# EAGLE design adapter_nucleo_f446re (EAGLE 9.5.0)
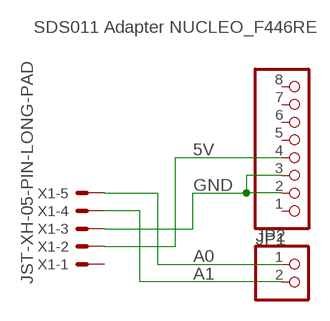
[diagram p0: schematic, sheet 1]

## Parts
JP1  PINHD-1X8  [1X08]
JP2  PINHD-1X2  [1X02]
X1  JST-XH-05-PIN-LONG-PAD  [JST-XH-05-PACKAGE-LONG-PAD]

## Nets
5V: JP1.4 X1.2
A0: JP2.1 X1.5
A1: JP2.2 X1.4
GND: JP1.2 JP1.3 X1.3
Unconnected: JP1.1 JP1.5 JP1.6 JP1.7 JP1.8 X1.1

## Notes on the sheet
- SDS011 Adapter NUCLEO_F446RE

## Library data of the parts
JP1 = pinhead:PINHD-1X8: PIN HEADER
JP2 = pinhead:PINHD-1X2: PIN HEADER
X1 = HSW_ATM-Connector_JST:JST-XH-05-PIN: JST XH Connector 2 Pin Wire to board connector. Pitch: 2,54 mm, (0.100") Number of pins: 5 Created by Rembrandt Electronics www.rembrandtelectronics.com

## Board
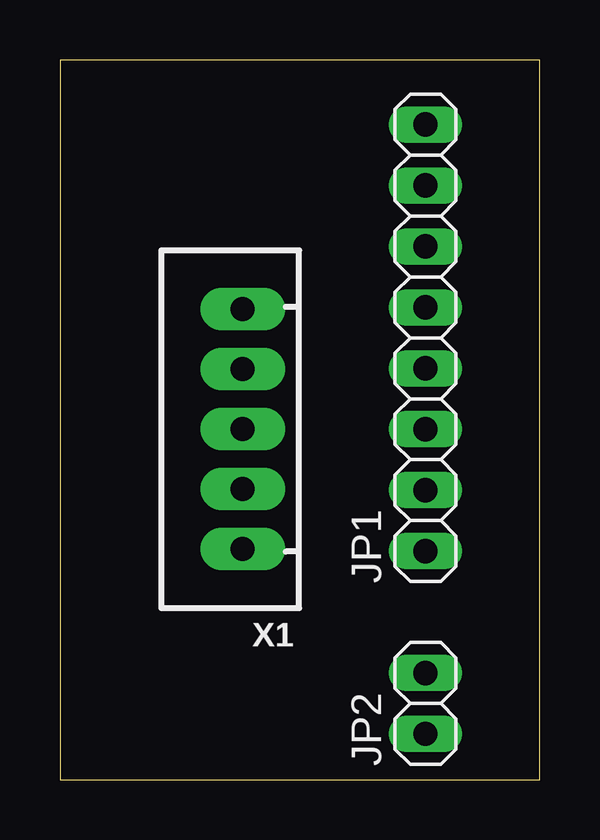
[diagram p1: board, top side]
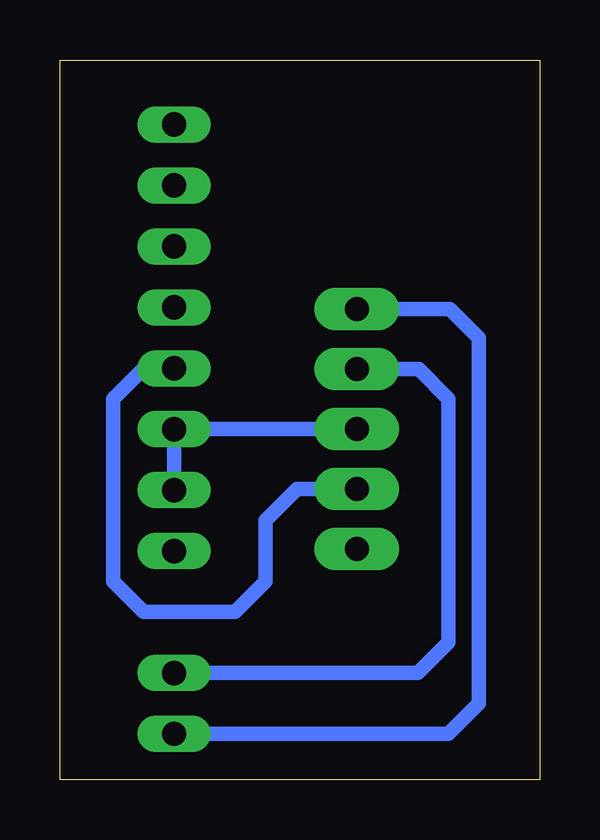
[diagram p2: board, bottom side, seen from below]

Size 20 x 30 mm. Coordinates in mm from the lower left corner, seen from the top.
Outline: 0,0 20,0 20,30 0,30 0,0
Copper layers (1*16): Top 0.035mm / dielectric 1.5mm / Bottom 0.035mm
Design rules "default": minimum track width 6mil, minimum drill 0.35mm, track to track 6mil, track to pad 6mil, pad to pad 6mil, via to via 6mil, smd to smd 6mil, copper to edge 40mil, drill to drill 6mil, minimum pad ring 10mil, minimum via ring 8mil, stop-mask expansion 4mil, vias tented up to drill 0mil, thermal gap 10mil

### Footprints (pad centres in the part's own frame; a part is rotated, then mirrored left to right if it is on the bottom)
1X08 = drill 1.016 long: 1 -8.89,0; 2 -6.35,0; 3 -3.81,0; 4 -1.27,0; 5 1.27,0; 6 3.81,0; 7 6.35,0; 8 8.89,0
1X02 = drill 1.016 long: 1 -1.27,0; 2 1.27,0
JST-XH-05-PACKAGE-LONG-PAD = drill 1 pad 1.778 long: 1 -5,0; 2 -2.5,0; 3 0,0; 4 2.5,0; 5 5,0

### Placement (x,y rotation side)
JP1  15.24,18.41 90 top
JP2  15.24,3.17 90 top
X1  7.62,14.61 90 top

### Tracks (layer width: path | path; a pad name or v marks a point on that pad's centre or on a via)
5V
  Bottom 0.61: X1.2 10.12,12.11 11.43,10.79 11.43,8.26 12.7,6.99 16.51,6.99 17.78,8.26 17.78,15.88 16.51,17.14 JP1.4
A0
  Bottom 0.61: X1.5 3.73,19.61 2.54,18.41 2.54,3.17 3.81,1.91 JP2.1
A1
  Bottom 0.61: X1.4 5.04,17.11 3.81,15.88 3.81,5.71 5.08,4.45 JP2.2
GND
  Bottom 0.61: X1.3 JP1.3 JP1.2